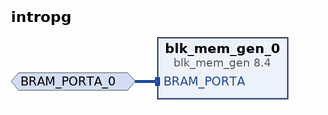
[diagram p0: block diagram of the top level]
# Vivado block design intropg, xc7a100tcsg324-1, Vivado 2021.1
create_bd_design intropg

create_bd_intf_port -mode Slave -vlnv xilinx.com:interface:bram_rtl:1.0 BRAM_PORTA_0

create_bd_cell -type ip -vlnv xilinx.com:ip:blk_mem_gen:8.4 blk_mem_gen_0
set_property -dict [list \
  CONFIG.Coe_File ../../../../../../intro.coe \
  CONFIG.EN_SAFETY_CKT true \
  CONFIG.Enable_32bit_Address false \
  CONFIG.Load_Init_File true \
  CONFIG.Read_Width_A 16 \
  CONFIG.Register_PortA_Output_of_Memory_Primitives true \
  CONFIG.Use_Byte_Write_Enable false \
  CONFIG.Use_RSTA_Pin true \
  CONFIG.Write_Depth_A 65538 \
  CONFIG.Write_Width_A 16 \
  CONFIG.use_bram_block Stand_Alone \
] [get_bd_cells blk_mem_gen_0]

# ---- connections ----

connect_bd_intf_net -intf_net BRAM_PORTA_0_1 [get_bd_intf_ports BRAM_PORTA_0] [get_bd_intf_pins blk_mem_gen_0/BRAM_PORTA]

validate_bd_design
save_bd_design
